# Altium schematic sheet BlockDiagram.SchDoc
size A; SheetNumber: 1; SheetTotal: 1
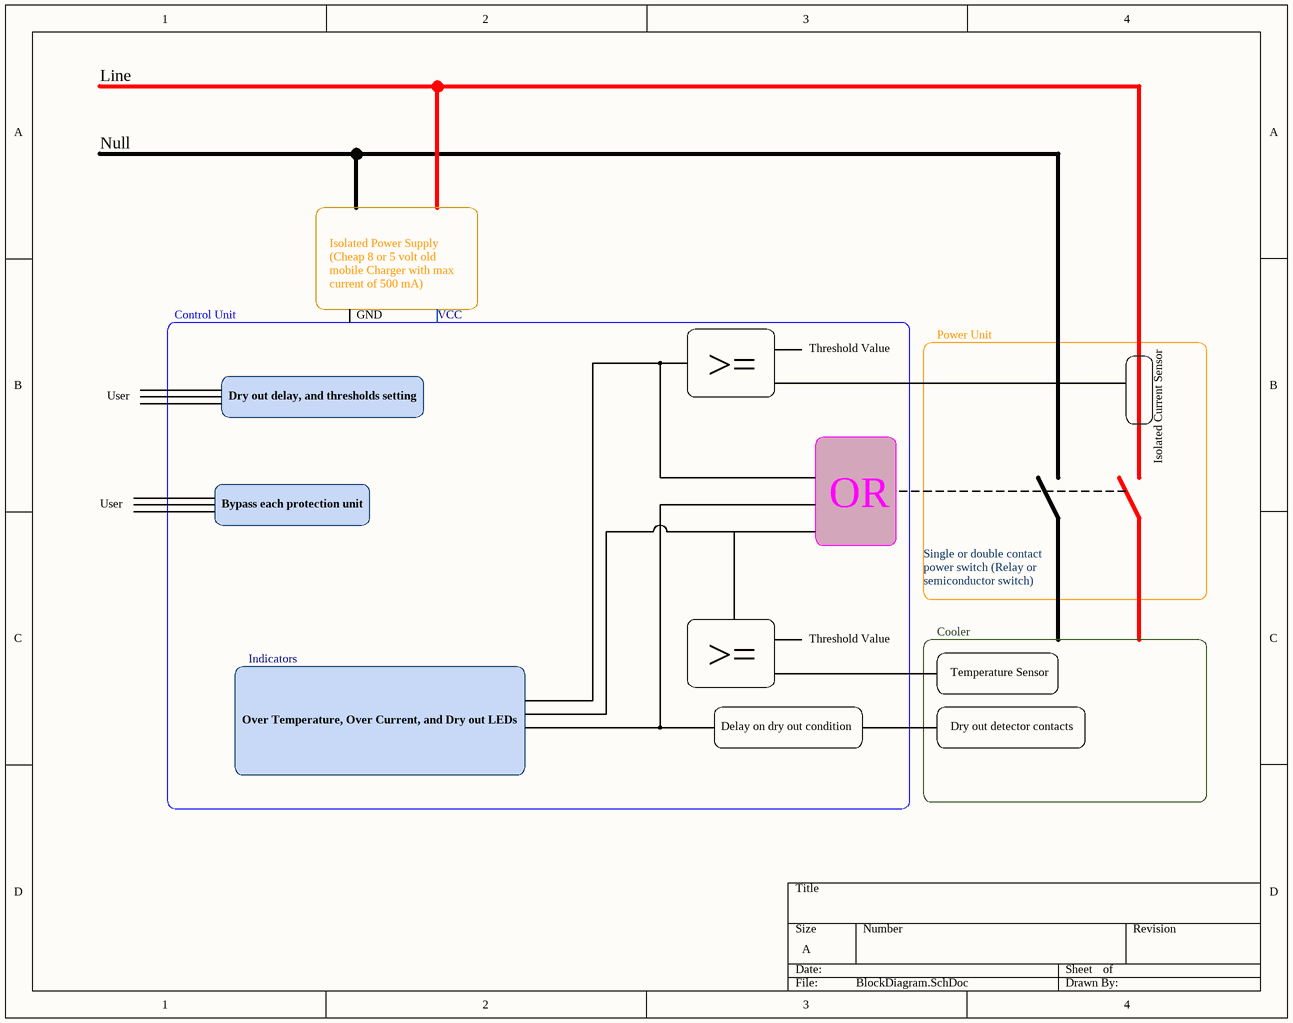
[diagram p0: BlockDiagram.SchDoc]

## Notes on the sheet
- Line
- Null
- Isolated Power Supply (Cheap 8 or 5 volt old mobile Charger with max current of 500 mA)
- Control Unit
- GND
- VCC
- Threshold Value
- Power Unit
- User
- Dry out delay, and thresholds setting
- >=
- Bypass each protection unit
- Isolated Current Sensor
- OR
- Single or double contact power switch (Relay or semiconductor switch)
- Cooler
- Indicators
- Temperature Sensor
- Over Temperature, Over Current, and Dry out LEDs
- Delay on dry out condition
- Dry out detector contacts